# EAGLE design MAC ADC v1.0 (EAGLE 7.2.0)
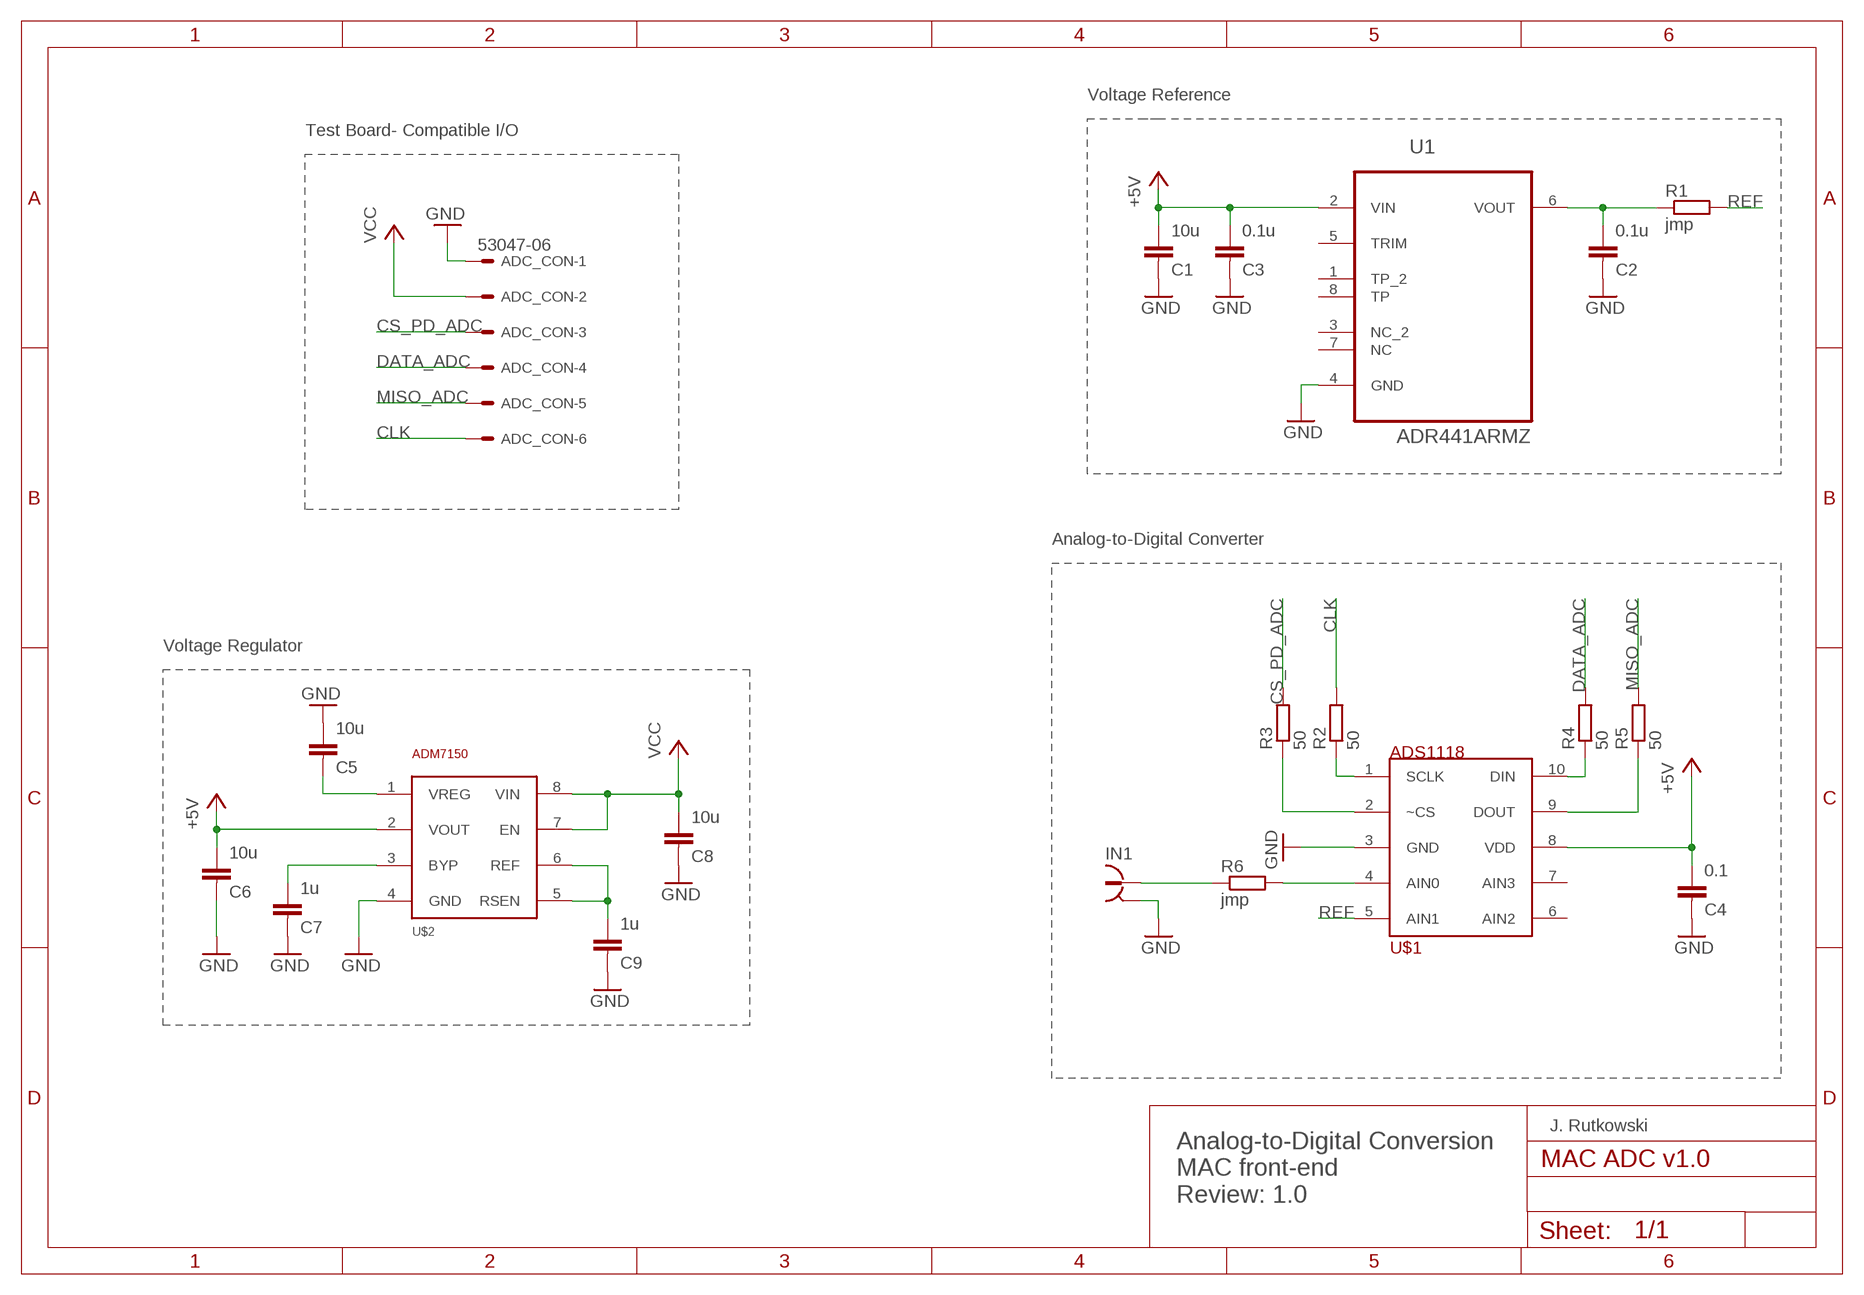
[diagram p0: schematic, sheet 1]

## Parts
ADC_CON  53047-06  [53047-06]
C1  10u  C-EUC0603K  [C0603K]
C2  0.1u  C-EUC0603K  [C0603K]
C3  0.1u  C-EUC0603K  [C0603K]
C4  0.1  C-EUC0603K  [C0603K]
C5  10u  C-EUC0603K  [C0603K]
C6  10u  C-EUC0603K  [C0603K]
C7  1u  C-EUC0603K  [C0603K]
C8  10u  C-EUC0603K  [C0603K]
C9  1u  C-EUC0603K  [C0603K]
IN1  734120110  [734120110]
R1  jmp  R-EU_R0603  [R0603]
R2  50  R-EU_R0603  [R0603]
R3  50  R-EU_R0603  [R0603]
R4  50  R-EU_R0603  [R0603]
R5  50  R-EU_R0603  [R0603]
R6  jmp  R-EU_R0603  [R0603]
U1  ADR441ARMZ  [SOP65P490X110-8N]
U$1  ADS1118IDGSR  [SOP50P490X110-10N]
U$2  ADM7150  [SO8]

## Nets
+5V: C1.1 C3.1 C4.1 C6.1 U1.2(VIN) U$1.8(VDD) U$2.2(VOUT)
CLK: ADC_CON.6 R2.2
CS_PD_ADC: ADC_CON.3 R3.2
DATA_ADC: ADC_CON.4 R4.2
GND: ADC_CON.1 C1.2 C2.2 C3.2 C4.2 C5.1 C6.2 C7.2 C8.2 C9.2 IN1.S@1 IN1.S@2 IN1.S@3 U1.4(GND) U$1.3(GND) U$2.4(GND)
MISO_ADC: ADC_CON.5 R5.2
N$1: C9.1 U$2.5(RSEN) U$2.6(REF)
N$2: C2.1 R1.1 U1.6(VOUT)
N$4: R2.1 U$1.1(SCLK)
N$5: C7.1 U$2.3(BYP)
N$6: R3.1 U$1.2(~CS)
N$7: C5.2 U$2.1(VREG)
N$8: R4.1 U$1.10(DIN)
N$9: R5.1 U$1.9(DOUT)
N$10: R6.2 U$1.4(AIN0)
N$12: IN1.1 R6.1
REF: R1.2 U$1.5(AIN1)
VCC: ADC_CON.2 C8.1 U$2.7(EN) U$2.8(VIN)
Unconnected: U1.1(TP_2) U1.3(NC_2) U1.5(TRIM) U1.7(NC) U1.8(TP) U$1.6(AIN2) U$1.7(AIN3)

## Notes on the sheet
- Voltage Reference
- Test Board- Compatible I/O
- Analog-to-Digital Converter
- Voltage Regulator
- J. Rutkowski
- Analog-to-Digital Conversion
  MAC front-end
  Review: 1.0

## Library data of the parts
ADC_CON = con-molex:53?-06: CONNECTOR wire to board 1.25 mm (.049 inch) pitch header; MPN: 53047-0610-C; OC_FARNELL: 9733078; OC_NEWARK: 03M2965
C1-C9 = rcl:C-EU: CAPACITOR, European symbol
IN1 = con-coax:734120110: MICRO COAXIAL CONNECTOR RECEPTACLE VERTICAL Source: Data sheet <http://www.molex.com/pdm_docs/sd/734120110_sd.pdf>
R1-R6 = rcl:R-EU_: RESISTOR, European symbol
U1 = ADI-Phase-2:ADR441ARMZ: Ultralow Noise, LDO XFET Voltage; MPN: ADR441ARMZ; OC_FARNELL: 1274160; OC_NEWARK: 19M0714; PACKAGE: MSOP-8; SUPPLIER: Analog Devices
U$1 = Texas Instruments_By_element14_Batch_1:ADS1118IDGSR: 16-Bit ADC with Integrated MUX, PGA, Temperature Sensor, Oscillator, and Reference; OC_FARNELL: 1947871; PACKAGE: VSSOP-10 (DGS)
U$2 = Custom-parts:ADM7150

## Board
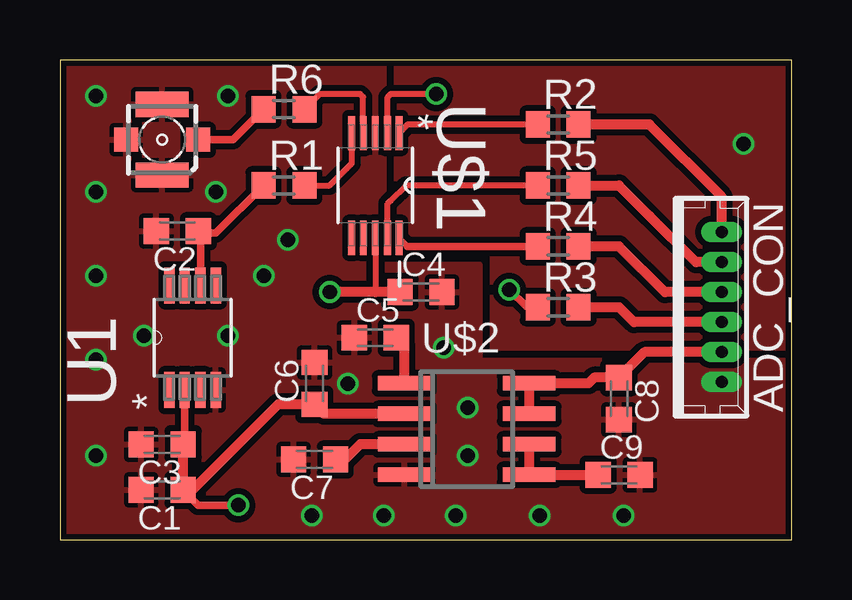
[diagram p1: board, top side]
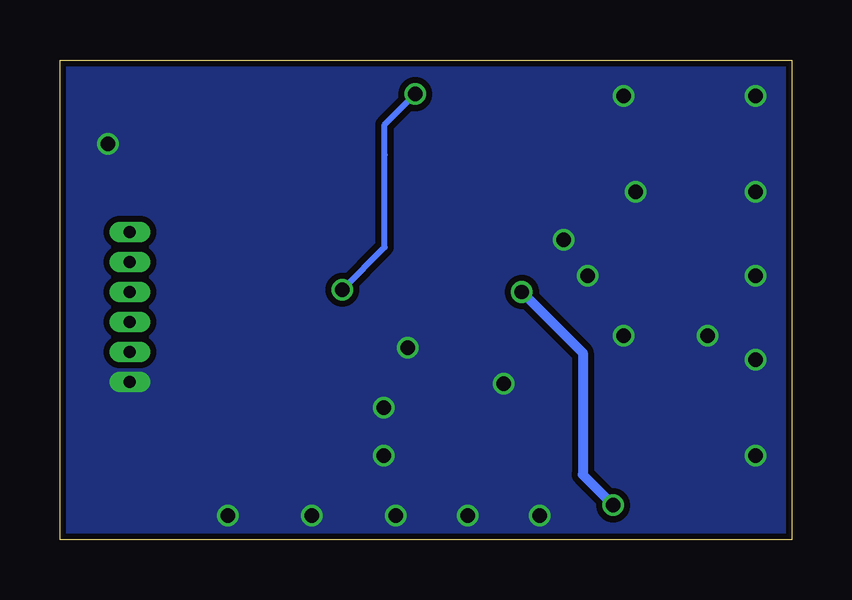
[diagram p2: board, bottom side, seen from below]

Size 30.5 x 20 mm. Coordinates in mm from the lower left corner, seen from the top.
Outline: 0,0 30.5,0 30.5,20 0,20 0,0
Copper layers (1*16): Top 0.018mm / dielectric 1.55mm / Bottom 0.018mm
Design rules "eC_2Layer_PClass6_BaseCopperO18_eCDefault *": minimum track width 0.15mm, minimum drill 0.35mm, track to track 0.15mm, track to pad 0.15mm, pad to pad 0.15mm, via to via 0.15mm, smd to smd 0mil, copper to edge 0.25mm, drill to drill 0.35mm, minimum pad ring 0.175mm, minimum via ring 0.125mm, stop-mask expansion 0mil, vias tented up to drill 0.45mm, thermal gap 0.2mm

### Footprints (pad centres in the part's own frame; a part is rotated, then mirrored left to right if it is on the bottom)
53047-06 = drill 0.5 pad 0.813 long: 1 3.125,0.45; 2 1.875,0.45; 3 0.625,0.45; 4 -0.625,0.45; 5 -1.875,0.45; 6 -3.125,0.45
C0603K = smd 1.05 x 1.08: 1 -0.875,0; 2 0.875,0
734120110 = smd 1 x 1: 1 0,-1.5; S@1 0,1.5 | smd 1.05 x 2.2: S@2 -1.475,0; S@3 1.475,0
R0603 = smd 1 x 1.1: 1 -0.85,0; 2 0.85,0
SOP65P490X110-8N = smd 1.499 x 0.432: 1 -2.184,0.965; 2 -2.184,0.33; 3 -2.184,-0.33; 4 -2.184,-0.965; 5 2.184,-0.965; 6 2.184,-0.33; 7 2.184,0.33; 8 2.184,0.965
SOP50P490X110-10N = smd 1.422 x 0.279: 1 -2.184,0.991; 2 -2.184,0.508; 3 -2.184,0; 4 -2.184,-0.508; 5 -2.184,-0.991; 6 2.184,-0.991; 7 2.184,-0.508; 8 2.184,0; 9 2.184,0.508; 10 2.184,0.991
SO8 = smd 0.6 x 2.2: 1 -1.905,-2.6; 2 -0.635,-2.6; 3 0.635,-2.6; 4 1.905,-2.6; 5 1.905,2.6; 6 0.635,2.6; 7 -0.635,2.6; 8 -1.905,2.6

### Placement (x,y rotation side)
ADC_CON  27.14,9.69 270 top
C1  4.26,2.07 180 top
C2  4.89,12.86 180 top
C3  4.26,3.97 180 top
C4  15.05,10.32 0 top
C5  13.15,8.42 0 top
C6  10.61,6.51 90 top
C7  10.61,3.34 180 top
C8  23.31,5.88 270 top
C9  23.31,2.7 0 top
IN1  4.26,16.67 90 top
R1  9.34,14.77 0 top
R2  20.77,17.31 0 top
R3  20.77,9.69 0 top
R4  20.77,12.23 0 top
R5  20.77,14.77 0 top
R6  9.34,17.94 0 top
U1  5.53,8.42 90 top
U$1  13.15,14.77 270 top
U$2  16.96,4.61 270 top

### Tracks (layer width: path | path; a pad name or v marks a point on that pad's centre or on a via)
+5V  (via drill 0.6)
  Top 0.254: U$1.8 13.15,10.32
  Top 0.305: U1.2 5.2,4.04 C3.1 | v7.43,1.43 5.77,1.43 C1.1
  Top 0.406: U$2.2 11,5.24 C6.1 9.1,5.64 8.07,4.61 5.53,2.07 C1.1 C3.1 | C4.1 13.15,10.32 v11.24,10.32
  Bottom 0.406: v11.24,10.32 8.7,7.78 8.7,2.7 8.07,2.07 v7.43,1.43
CLK
  Top 0.406: ADC_CON.6 27.59,14.3 24.58,17.31 R2.2
CS_PD_ADC
  Top 0.406: R3.2 23.31,9.69 23.93,9.06 ADC_CON.3
DATA_ADC
  Top 0.406: ADC_CON.4 25.22,10.31 23.31,12.23 R4.2
GND  (via drill 0.6)
  other vias: 28.5,16.5 1.5,18.5 7,18.5 1.5,14.5 6.5,14.5 1.5,11 9.5,12.5 8.5,11 3.5,8.5 7,8.5 1.5,7.5 1.5,3.5 10.5,1 13.5,1 16.5,1 20,1 23.5,1 17,5.5 17,3.5 16,8 12,6.5
  pour Top (isolate 0.254): 0,20 13.5,20 13.5,11.5 17.5,11.5 17.5,7.5 25.5,7.5 25.5,0 0,0
  pour Top (isolate 0.254): 14,20 14,12 18,12 18,8 30.5,8 30.5,20
  pour Bottom (isolate 0.254, no thermals): 0,20 30.5,20 30.5,0 0,0
  pour Top (isolate 0.254, no thermals): 26,7.5 30.5,7.5 30.5,0 25,0 25,7.5
MISO_ADC
  Top 0.406: ADC_CON.5 26.51,11.56 24.58,13.5 23.31,14.77 R5.2
N$1
  Top 0.406: C9.1 U$2.5 U$2.6
N$2
  Top 0.305: U1.6 5.86,12.77 | 5.86,12.77 C2.1 | 5.86,12.77 6.49,12.77 R1.1
N$4
  Top 0.254: R2.1 14.49,17.31 U$1.1
N$5
  Top 0.406: U$2.3 12.51,3.97 11.88,3.34 C7.1
N$6  (via drill 0.6)
  Top 0.254: U$1.2 13.66,18.45 13.78,18.58 v15.69,18.58
  Top 0.305: 20,9.61 R3.1 19.46,9.69 v18.73,10.42
  Bottom 0.254: v18.73,10.42 16.96,12.19 16.96,16.04 16.96,17.31 v15.69,18.58
N$7
  Top 0.406: U$2.1 14.36,8.08 C5.2
N$8
  Top 0.254: 14.49,12.23 U$1.10
  Top 0.305: R4.1 14.49,12.23
N$9
  Top 0.254: R5.1 14.42,14.77 13.78,14.13 13.66,14.01 U$1.9
N$10
  Top 0.254: U$1.4 12.64,18.45 12.51,18.58 10.82,18.58 R6.2
N$12
  Top 0.305: IN1.1 7.22,16.67 R6.1
REF
  Top 0.254: R1.2 11.24,14.77 11.88,15.4 12.16,15.68 U$1.5
VCC
  Top 0.406: ADC_CON.2 24.37,7.81 C8.1 22.28,6.75 22.04,6.51 U$2.8 U$2.7

### Text on the board
Top_Legend: R6 | INP | R2 | FEMTO-ST 2016 | R1 | R5 | U$1 | R4 | C2 | C4 | C5 | R3 | I/O | U1 | C6 | C8 | C3 | C1 | C7 | U$2 | C9 | MAC ADC / Rev. 1.0